# EAGLE schematic CP State LEDs (EAGLE 6.5.0)
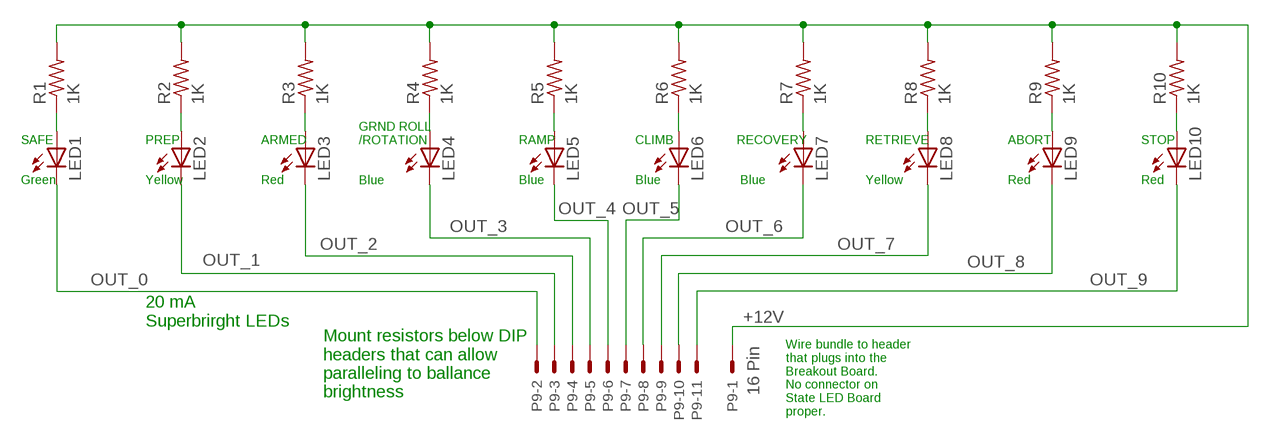
[diagram p0: schematic, sheet 1]

## Parts
LED1  LED5MM  [LED5MM]
LED2  LED5MM  [LED5MM]
LED3  LED5MM  [LED5MM]
LED4  LED5MM  [LED5MM]
LED5  LED5MM  [LED5MM]
LED6  LED5MM  [LED5MM]
LED7  LED5MM  [LED5MM]
LED8  LED5MM  [LED5MM]
LED9  LED5MM  [LED5MM]
LED10  LED5MM  [LED5MM]
P9  16 Pin  C-GRID-20-70543  [70543-20]
R1  1K  R-US_V234/12  [V234/12]
R2  1K  R-US_V234/12  [V234/12]
R3  1K  R-US_V234/12  [V234/12]
R4  1K  R-US_V234/12  [V234/12]
R5  1K  R-US_V234/12  [V234/12]
R6  1K  R-US_V234/12  [V234/12]
R7  1K  R-US_V234/12  [V234/12]
R8  1K  R-US_V234/12  [V234/12]
R9  1K  R-US_V234/12  [V234/12]
R10  1K  R-US_V234/12  [V234/12]

## Nets
+12V: P9.1 R1.2 R2.2 R3.2 R4.2 R5.2 R6.2 R7.2 R8.2 R9.2 R10.2
N$1: LED1.A R1.1
N$2: LED2.A R2.1
N$3: LED3.A R3.1
N$4: LED4.A R4.1
N$5: LED5.A R5.1
N$6: LED6.A R6.1
N$7: LED7.A R7.1
N$8: LED8.A R8.1
N$9: LED9.A R9.1
N$10: LED10.A R10.1
OUT_0: LED1.K(C) P9.2
OUT_1: LED2.K(C) P9.3
OUT_2: LED3.K(C) P9.4
OUT_3: LED4.K(C) P9.5
OUT_4: LED5.K(C) P9.6
OUT_5: LED6.K(C) P9.7
OUT_6: LED7.K(C) P9.8
OUT_7: LED8.K(C) P9.9
OUT_8: LED9.K(C) P9.10
OUT_9: LED10.K(C) P9.11
Unconnected: P9.12 P9.13 P9.14 P9.15 P9.16 P9.17 P9.18 P9.19 P9.20

## Notes on the sheet
- SAFE
  
  
  Green
- PREP
  
  
  Yellow
- ARMED
  
  
  Red
- GRND ROLL
  /ROTATION
  
  
  Blue
- RAMP
  
  
  Blue
- CLIMB
  
  
  Blue
- RECOVERY
  
  
   Blue
- RETRIEVE
  
  
  Yellow
- ABORT
  
  
  Red
- STOP
  
  
  Red
- 20 mA 
  Superbrirght LEDs
- Mount resistors below DIP
  headers that can allow 
  paralleling to ballance 
  brightness
- Wire bundle to header
  that plugs into the
  Breakout Board.
  No connector on 
  State LED Board
  proper.

## Library data of the parts
LED1-LED10 = led:LED: LED OSRAM: - CHIPLED LG R971, LG N971, LY N971, LG Q971, LY Q971, LO R971, LY R971 LH N974, LH R974 LS Q976, LO Q976, LY Q976 LO Q996 - Hyper CHIPLED LW Q18S LB Q993, LB Q99A, LB R99A - SideLED LS A670, LO A670, LY A670, LG A670, LP A670 LB A673, LV A673, LT A673, LW A673 LH A674 LY A675 LS A676, LA A676, LO A676, LY A676, LW A676 LS A679, LY A679, LG A679 - Hyper Micro SIDELED® LS Y876, LA Y876, LO Y876, LY Y876 LT Y87S - SmartLED LW L88C, LW L88S LB L89C, LB L89S, LG L890 LS L89K, LO L89K, LY L89K LS L896, LA L896, LO L896, LY L896 - TOPLED LS T670, LO T670, LY T670, LG T670, LP T670 LSG T670, LSP T670, LSY T670, LOP T670, LYG T670 LG T671, LOG T671, LSG T671 LB T673, LV T673, LT T673, LW T673 LH T674 LS T676, LA T676, LO T676, LY T676, LB T676, LH T676, LSB T676, LW T676 LB T67C, LV T67C, LT T67C, LS T67K, LO T67K, LY T67K, LW E67C LS E67B, LA E67B, LO E67B, LY E67B, LB E67C, LV E67C, LT E67C LW T67C LS T679, LY T679, LG T679 LS T770, LO T770, LY T770, LG T770, LP T770 LB T773, LV T773, LT T773, LW T773 LH T774 LS E675, LA E675, LY E675, LS T675 LS T776, LA T776, LO T776, LY T776, LB T776 LHGB T686 LT T68C, LB T68C - Hyper Mini TOPLED® LB M676 - Mini TOPLED Santana® LG M470 LS M47K, LO M47K, LY M47K Source: http://www.osram.convergy.de LUXEON: - LUMILED® LXK2-PW12-R00, LXK2-PW12-S00, LXK2-PW14-U00, LXK2-PW14-V00 LXK2-PM12-R00, LXK2-PM12-S00, LXK2-PM14-U00 LXK2-PE12-Q00, LXK2-PE12-R00, LXK2-PE12-S00, LXK2-PE14-T00, LXK2-PE14-U00 LXK2-PB12-K00, LXK2-PB12-L00, LXK2-PB12-M00, LXK2-PB14-N00, LXK2-PB14-P00, LXK2-PB14-Q00 LXK2-PR12-L00, LXK2-PR12-M00, LXK2-PR14-Q00, LXK2-PR14-R00 LXK2-PD12-Q00, LXK2-PD12-R00, LXK2-PD12-S00 LXK2-PH12-R00, LXK2-PH12-S00 LXK2-PL12-P00, LXK2-PL12-Q00, LXK2-PL12-R00 Source: www.luxeon.com KINGBRIGHT: KA-3528ASYC Source: www.kingbright.com
P9 = con-molex:C-GRID-20: CONNECTOR wire to board 2.54 mm (0.100") pitch header; OC_FARNELL: unknown; OC_NEWARK: unknown
R1-R10 = resistor:R-US_: RESISTOR, American symbol